# EAGLE design M930 (EAGLE 6.6.0)
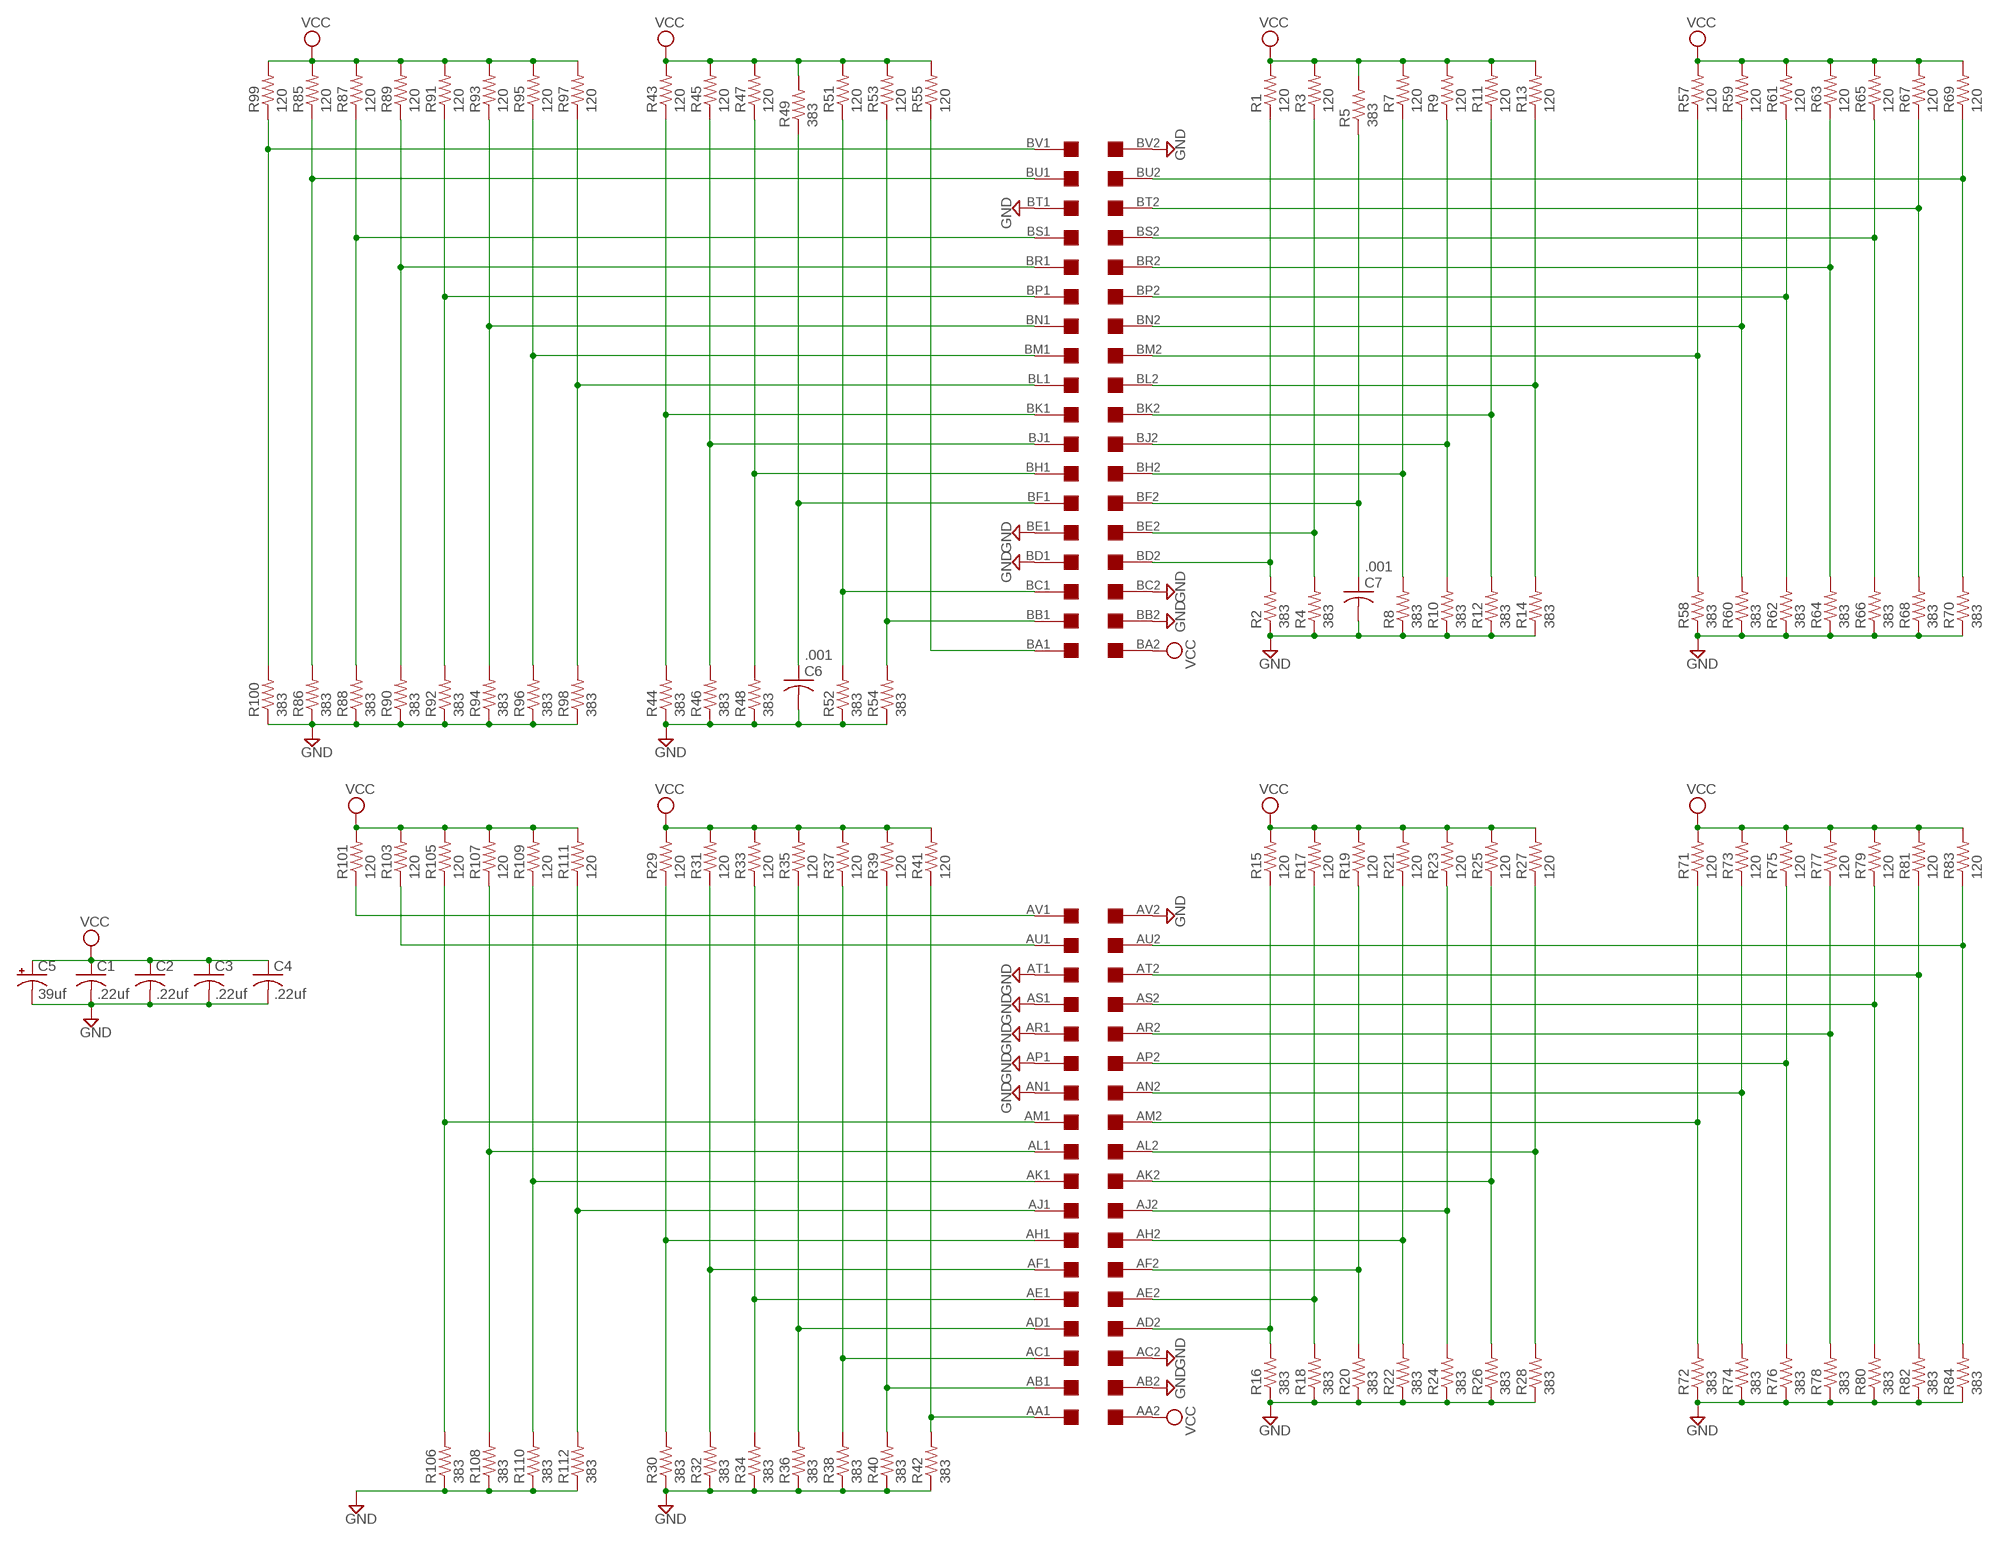
[diagram p0: schematic, sheet 1]

## Parts
C1  .22uf  C-US050-025X075  [C050-025X075]
C2  .22uf  C-US050-025X075  [C050-025X075]
C3  .22uf  C-US050-025X075  [C050-025X075]
C4  .22uf  C-US050-025X075  [C050-025X075]
C5  39uf  CPOL-USE15-5AXIAL  [E15-5]
C6  .001  C-US050-025X075  [C050-025X075]
C7  .001  C-US050-025X075  [C050-025X075]
R1  120  R-US_0207/10  [0207/10]
R2  383  R-US_0207/10  [0207/10]
R3  120  R-US_0207/10  [0207/10]
R4  383  R-US_0207/10  [0207/10]
R5  383  R-US_0207/10  [0207/10]
R7  120  R-US_0207/10  [0207/10]
R8  383  R-US_0207/10  [0207/10]
R9  120  R-US_0207/10  [0207/10]
R10  383  R-US_0207/10  [0207/10]
R11  120  R-US_0207/10  [0207/10]
R12  383  R-US_0207/10  [0207/10]
R13  120  R-US_0207/10  [0207/10]
R14  383  R-US_0207/10  [0207/10]
R15  120  R-US_0207/10  [0207/10]
R16  383  R-US_0207/10  [0207/10]
R17  120  R-US_0207/10  [0207/10]
R18  383  R-US_0207/10  [0207/10]
R19  120  R-US_0207/10  [0207/10]
R20  383  R-US_0207/10  [0207/10]
R21  120  R-US_0207/10  [0207/10]
R22  383  R-US_0207/10  [0207/10]
R23  120  R-US_0207/10  [0207/10]
R24  383  R-US_0207/10  [0207/10]
R25  120  R-US_0207/10  [0207/10]
R26  383  R-US_0207/10  [0207/10]
R27  120  R-US_0207/10  [0207/10]
R28  383  R-US_0207/10  [0207/10]
R29  120  R-US_0207/10  [0207/10]
R30  383  R-US_0207/10  [0207/10]
R31  120  R-US_0207/10  [0207/10]
R32  383  R-US_0207/10  [0207/10]
R33  120  R-US_0207/10  [0207/10]
R34  383  R-US_0207/10  [0207/10]
R35  120  R-US_0207/10  [0207/10]
R36  383  R-US_0207/10  [0207/10]
R37  120  R-US_0207/10  [0207/10]
R38  383  R-US_0207/10  [0207/10]
R39  120  R-US_0207/10  [0207/10]
R40  383  R-US_0207/10  [0207/10]
R41  120  R-US_0207/10  [0207/10]
R42  383  R-US_0207/10  [0207/10]
R43  120  R-US_0207/10  [0207/10]
R44  383  R-US_0207/10  [0207/10]
R45  120  R-US_0207/10  [0207/10]
R46  383  R-US_0207/10  [0207/10]
R47  120  R-US_0207/10  [0207/10]
R48  383  R-US_0207/10  [0207/10]
R49  383  R-US_0207/10  [0207/10]
R51  120  R-US_0207/10  [0207/10]
R52  383  R-US_0207/10  [0207/10]
R53  120  R-US_0207/10  [0207/10]
R54  383  R-US_0207/10  [0207/10]
R55  120  R-US_0207/10  [0207/10]
R57  120  R-US_0207/10  [0207/10]
R58  383  R-US_0207/10  [0207/10]
R59  120  R-US_0207/10  [0207/10]
R60  383  R-US_0207/10  [0207/10]
R61  120  R-US_0207/10  [0207/10]
R62  383  R-US_0207/10  [0207/10]
R63  120  R-US_0207/10  [0207/10]
R64  383  R-US_0207/10  [0207/10]
R65  120  R-US_0207/10  [0207/10]
R66  383  R-US_0207/10  [0207/10]
R67  120  R-US_0207/10  [0207/10]
R68  383  R-US_0207/10  [0207/10]
R69  120  R-US_0207/10  [0207/10]
R70  383  R-US_0207/10  [0207/10]
R71  120  R-US_0207/10  [0207/10]
R72  383  R-US_0207/10  [0207/10]
R73  120  R-US_0207/10  [0207/10]
R74  383  R-US_0207/10  [0207/10]
R75  120  R-US_0207/10  [0207/10]
R76  383  R-US_0207/10  [0207/10]
R77  120  R-US_0207/10  [0207/10]
R78  383  R-US_0207/10  [0207/10]
R79  120  R-US_0207/10  [0207/10]
R80  383  R-US_0207/10  [0207/10]
R81  120  R-US_0207/10  [0207/10]
R82  383  R-US_0207/10  [0207/10]
R83  120  R-US_0207/10  [0207/10]
R84  383  R-US_0207/10  [0207/10]
R85  120  R-US_0207/10  [0207/10]
R86  383  R-US_0207/10  [0207/10]
R87  120  R-US_0207/10  [0207/10]
R88  383  R-US_0207/10  [0207/10]
R89  120  R-US_0207/10  [0207/10]
R90  383  R-US_0207/10  [0207/10]
R91  120  R-US_0207/10  [0207/10]
R92  383  R-US_0207/10  [0207/10]
R93  120  R-US_0207/10  [0207/10]
R94  383  R-US_0207/10  [0207/10]
R95  120  R-US_0207/10  [0207/10]
R96  383  R-US_0207/10  [0207/10]
R97  120  R-US_0207/10  [0207/10]
R98  383  R-US_0207/10  [0207/10]
R99  120  R-US_0207/10  [0207/10]
R100  383  R-US_0207/10  [0207/10]
R101  120  R-US_0207/10  [0207/10]
R103  120  R-US_0207/10  [0207/10]
R105  120  R-US_0207/10  [0207/10]
R106  383  R-US_0207/10  [0207/10]
R107  120  R-US_0207/10  [0207/10]
R108  383  R-US_0207/10  [0207/10]
R109  120  R-US_0207/10  [0207/10]
R110  383  R-US_0207/10  [0207/10]
R111  120  R-US_0207/10  [0207/10]
R112  383  R-US_0207/10  [0207/10]
U$1  DOUBLE  [EDGE-CON4]

## Nets
AA1: R41.1 R42.2 U$1.AA1
AB1: R39.1 R40.2 U$1.AB1
AC1: R37.1 R38.2 U$1.AC1
AD1: R35.1 R36.2 U$1.AD1
AD2: R15.1 R16.2 U$1.AD2
AE1: R33.1 R34.2 U$1.AE1
AE2: R17.1 R18.2 U$1.AE2
AF1: R31.1 R32.2 U$1.AF1
AF2: R19.1 R20.2 U$1.AF2
AH1: R29.1 R30.2 U$1.AH1
AH2: R21.1 R22.2 U$1.AH2
AJ1: R111.1 R112.2 U$1.AJ1
AJ2: R23.1 R24.2 U$1.AJ2
AK1: R109.1 R110.2 U$1.AK1
AK2: R25.1 R26.2 U$1.AK2
AL1: R107.1 R108.2 U$1.AL1
AL2: R27.1 R28.2 U$1.AL2
AM1: R105.1 R106.2 U$1.AM1
AM2: R71.1 R72.2 U$1.AM2
AN2: R73.1 R74.2 U$1.AN2
AP2: R75.1 R76.2 U$1.AP2
AR2: R77.1 R78.2 U$1.AR2
AS2: R79.1 R80.2 U$1.AS2
AT2: R81.1 R82.2 U$1.AT2
AU1: R103.1 U$1.AU1
AU2: R83.1 R84.2 U$1.AU2
AV1: R101.1 U$1.AV1
BA1: R55.1 U$1.BA1
BB1: R53.1 R54.2 U$1.BB1
BC1: R51.1 R52.2 U$1.BC1
BD2: R1.1 R2.2 U$1.BD2
BE2: R3.1 R4.2 U$1.BE2
BF1: C6.1 R49.1 U$1.BF1
BF2: C7.1 R5.1 U$1.BF2
BH1: R47.1 R48.2 U$1.BH1
BH2: R7.1 R8.2 U$1.BH2
BJ1: R45.1 R46.2 U$1.BJ1
BJ2: R9.1 R10.2 U$1.BJ2
BK1: R43.1 R44.2 U$1.BK1
BK2: R11.1 R12.2 U$1.BK2
BL1: R97.1 R98.2 U$1.BL1
BL2: R13.1 R14.2 U$1.BL2
BM1: R95.1 R96.2 U$1.BM1
BM2: R57.1 R58.2 U$1.BM2
BN1: R93.1 R94.2 U$1.BN1
BN2: R59.1 R60.2 U$1.BN2
BP1: R91.1 R92.2 U$1.BP1
BP2: R61.1 R62.2 U$1.BP2
BR1: R89.1 R90.2 U$1.BR1
BR2: R63.1 R64.2 U$1.BR2
BS1: R87.1 R88.2 U$1.BS1
BS2: R65.1 R66.2 U$1.BS2
BT2: R67.1 R68.2 U$1.BT2
BU1: R85.1 R86.2 U$1.BU1
BU2: R69.1 R70.2 U$1.BU2
BV1: R99.1 R100.2 U$1.BV1
GND: C1.2 C2.2 C3.2 C4.2 C5.- C6.2 C7.2 R2.1 R4.1 R8.1 R10.1 R12.1 R14.1 R16.1 R18.1 R20.1 R22.1 R24.1 R26.1 R28.1 R30.1 R32.1 R34.1 R36.1 R38.1 R40.1 R42.1 R44.1 R46.1 R48.1 R52.1 R54.1 R58.1 R60.1 R62.1 R64.1 R66.1 R68.1 R70.1 R72.1 R74.1 R76.1 R78.1 R80.1 R82.1 R84.1 R86.1 R88.1 R90.1 R92.1 R94.1 R96.1 R98.1 R100.1 R106.1 R108.1 R110.1 R112.1 U$1.AB2 U$1.AC2 U$1.AN1 U$1.AP1 U$1.AR1 U$1.AS1 U$1.AT1 U$1.AV2 U$1.BB2 U$1.BC2 U$1.BD1 U$1.BE1 U$1.BT1 U$1.BV2
VCC: C1.1 C2.1 C3.1 C4.1 C5.+ R1.2 R3.2 R5.2 R7.2 R9.2 R11.2 R13.2 R15.2 R17.2 R19.2 R21.2 R23.2 R25.2 R27.2 R29.2 R31.2 R33.2 R35.2 R37.2 R39.2 R41.2 R43.2 R45.2 R47.2 R49.2 R51.2 R53.2 R55.2 R57.2 R59.2 R61.2 R63.2 R65.2 R67.2 R69.2 R71.2 R73.2 R75.2 R77.2 R79.2 R81.2 R83.2 R85.2 R87.2 R89.2 R91.2 R93.2 R95.2 R97.2 R99.2 R101.2 R103.2 R105.2 R107.2 R109.2 R111.2 U$1.AA2 U$1.BA2

## Library data of the parts
C1-C4 C6 C7 = rcl:C-US: CAPACITOR, American symbol
C5 = rcl:CPOL-US: POLARIZED CAPACITOR, American symbol
R1-R5 R7-R49 R51-R55 R57-R101 R103 R105-R112 = rcl:R-US_: RESISTOR, American symbol
U$1 = dec-con:DOUBLE: Double-Height DEC board

## Board
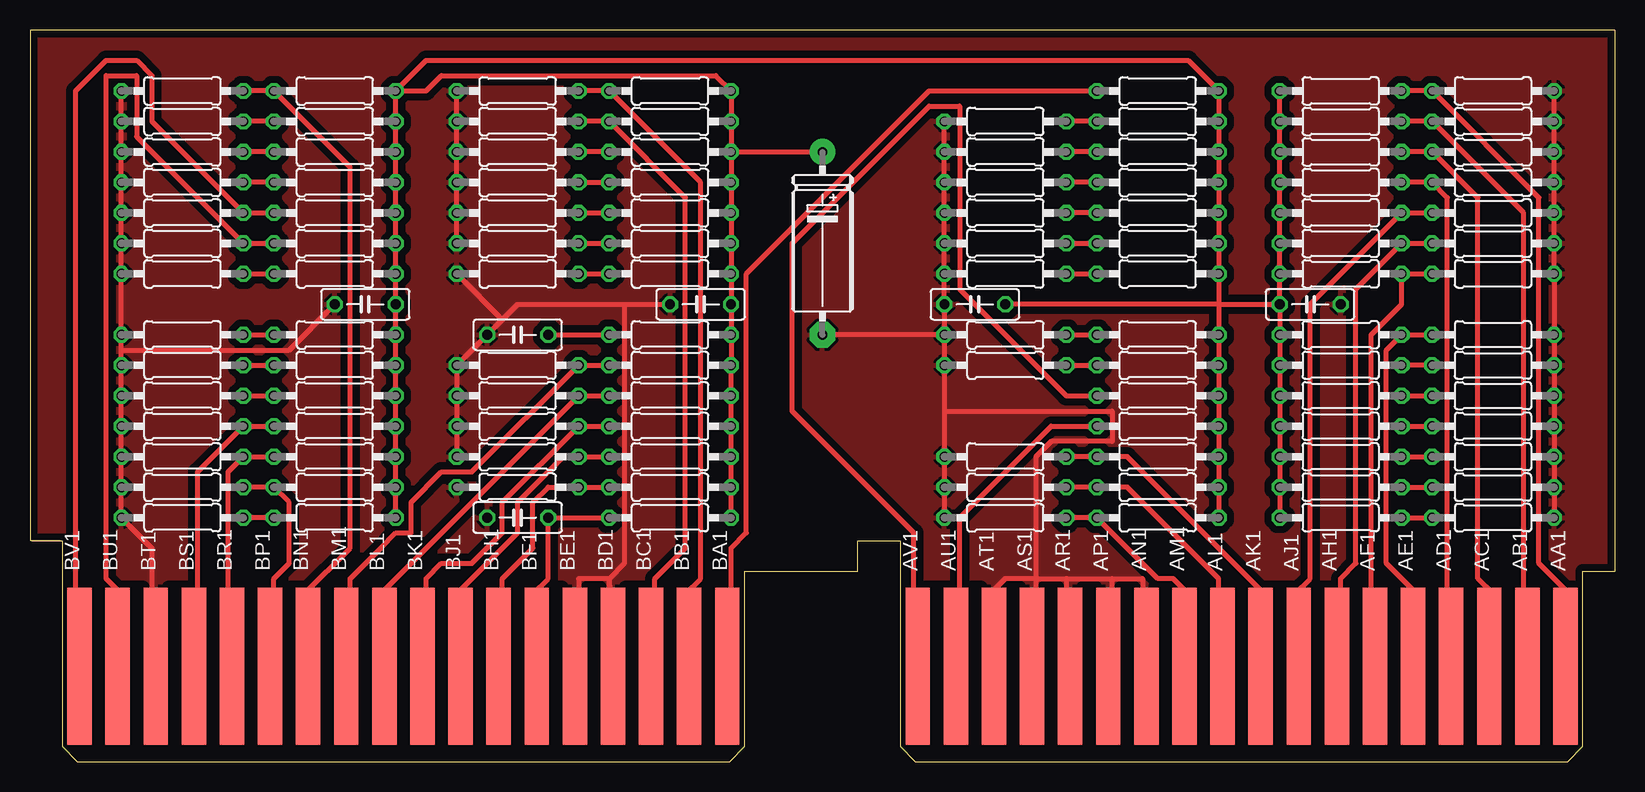
[diagram p1: board, top side]
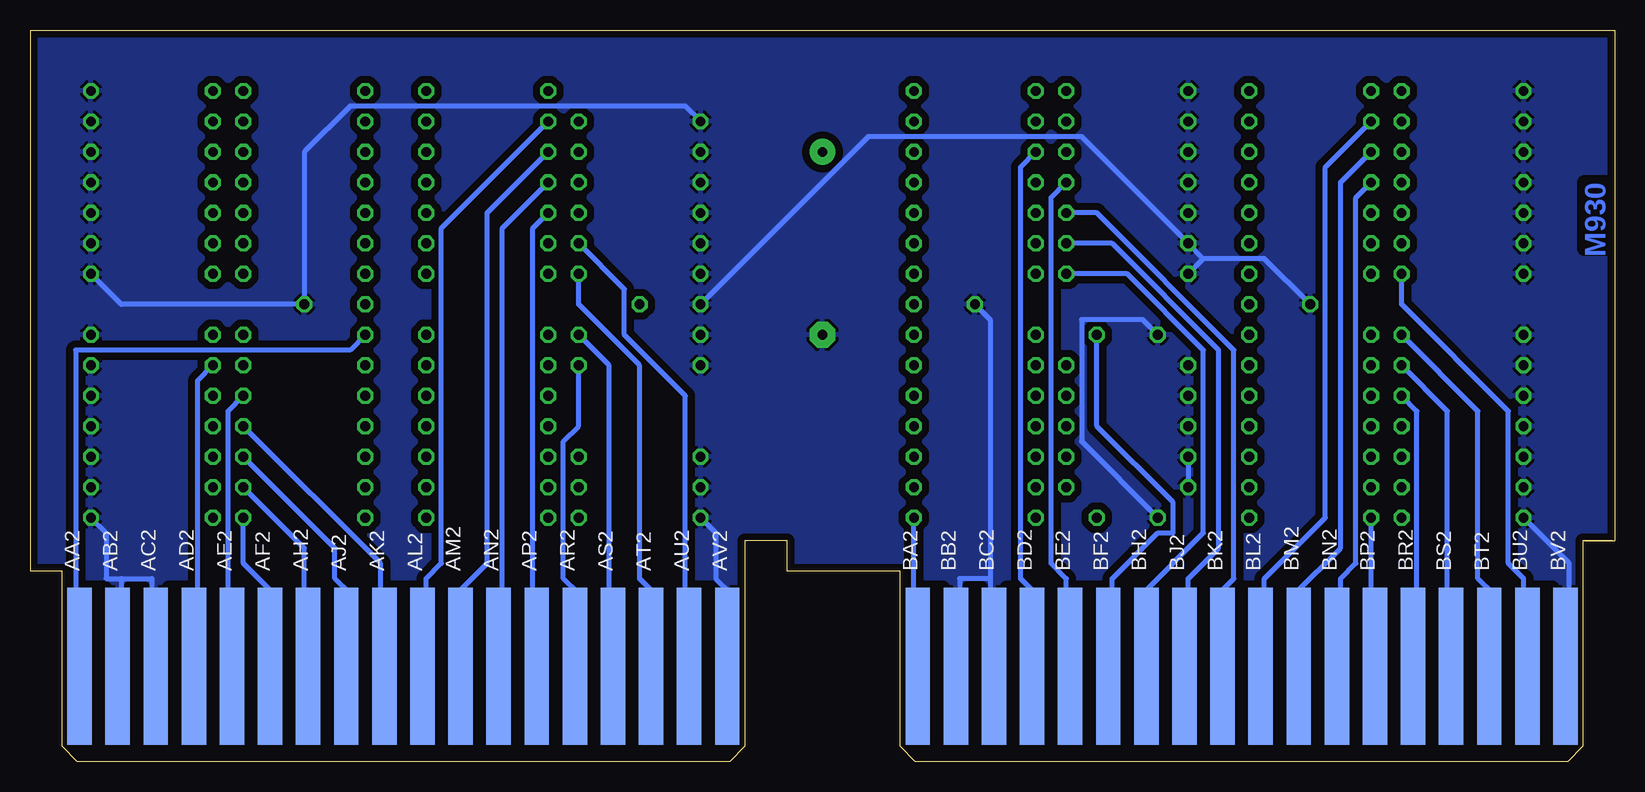
[diagram p2: board, bottom side, seen from below]

Size 132.08 x 60.96 mm. Coordinates in mm from the lower left corner, seen from the top.
Outline: 132.08,15.88 132.08,60.96 0,60.96 0,18.41 2.54,18.41
Copper layers (1+16): Top 0.035mm / dielectric 1.5mm / Bottom 0.035mm
Design rules "16mils": minimum track width 16mil, minimum drill 32mil, track to track 15mil, track to pad 10mil, pad to pad 10mil, via to via 10mil, smd to smd 10mil, copper to edge 13mil, drill to drill 10mil, minimum pad ring 10mil, minimum via ring 8mil, stop-mask expansion 0mil, vias tented up to drill 0mil, thermal gap 10mil

### Footprints (pad centres in the part's own frame; a part is rotated, then mirrored left to right if it is on the bottom)
C050-025X075 = drill 0.813 octagon: 1 -2.54,0; 2 2.54,0
E15-5 = drill 0.813 pad 2.159: + -7.62,0 | drill 0.813 pad 2.159 octagon: - 7.62,0
0207/10 = drill 0.813 octagon: 1 -5.08,0; 2 5.08,0
EDGE-CON4 = smd 13.106 x 2.032: AA1 7.938,4.128; AB1 7.938,7.303; AC1 7.938,10.477; AD1 7.938,13.652; AE1 7.938,16.828; AF1 7.938,20.003; AH1 7.938,23.177; AJ1 7.938,26.352; AK1 7.938,29.527; AL1 7.938,32.703; AM1 7.938,35.877; AN1 7.938,39.053; AP1 7.938,42.227; AR1 7.938,45.403; AS1 7.938,48.578; AT1 7.938,51.752; AU1 7.938,54.928; AV1 7.938,58.102; BA1 7.938,73.978; BB1 7.938,77.153; BC1 7.938,80.328; BD1 7.938,83.502; BE1 7.938,86.677; BF1 7.938,89.853; BH1 7.938,93.028; BJ1 7.938,96.203; BK1 7.938,99.377; BL1 7.938,102.552; BM1 7.938,105.728; BN1 7.938,108.903; BP1 7.938,112.078; BR1 7.938,115.252; BS1 7.938,118.427; BT1 7.938,121.603; BU1 7.938,124.778; BV1 7.938,127.953 | smd 13.106 x 2.032 bottom: AA2 7.938,4.128; AB2 7.938,7.303; AC2 7.938,10.477; AD2 7.938,13.652; AE2 7.938,16.828; AF2 7.938,20.003; AH2 7.938,23.177; AJ2 7.938,26.352; AK2 7.938,29.527; AL2 7.938,32.703; AM2 7.938,35.877; AN2 7.938,39.053; AP2 7.938,42.227; AR2 7.938,45.403; AS2 7.938,48.578; AT2 7.938,51.752; AU2 7.938,54.928; AV2 7.938,58.102; BA2 7.938,73.978; BB2 7.938,77.153; BC2 7.938,80.328; BD2 7.938,83.502; BE2 7.938,86.677; BF2 7.938,89.853; BH2 7.938,93.028; BJ2 7.938,96.203; BK2 7.938,99.377; BL2 7.938,102.552; BM2 7.938,105.728; BN2 7.938,108.903; BP2 7.938,112.078; BR2 7.938,115.252; BS2 7.938,118.427; BT2 7.938,121.603; BU2 7.938,124.778; BV2 7.938,127.953

### Placement (x,y rotation side)
C1  106.68,38.1 0 top
C2  78.74,38.1 180 top
C3  55.88,38.1 180 top
C4  27.94,38.1 180 top
C5  66.04,43.18 270 top
C6  40.64,20.32 180 top
C7  40.64,35.56 180 top
R1  53.34,50.8 0 top
R2  40.64,50.8 0 top
R3  53.34,48.26 0 top
R4  40.64,48.26 0 top
R5  53.34,35.56 0 top
R7  53.34,40.64 0 top
R8  40.64,40.64 0 top
R9  53.34,43.18 0 top
R10  40.64,43.18 0 top
R11  53.34,45.72 0 top
R12  40.64,45.72 0 top
R13  25.4,53.34 0 top
R14  12.7,53.34 0 top
R15  109.22,33.02 180 top
R16  121.92,33.02 180 top
R17  109.22,30.48 180 top
R18  121.92,30.48 180 top
R19  109.22,20.32 180 top
R20  121.92,20.32 180 top
R21  109.22,22.86 180 top
R22  121.92,22.86 180 top
R23  109.22,25.4 180 top
R24  121.92,25.4 180 top
R25  109.22,27.94 180 top
R26  121.92,27.94 180 top
R27  93.98,53.34 0 top
R28  81.28,53.34 0 top
R29  109.22,43.18 180 top
R30  121.92,43.18 180 top
R31  109.22,40.64 180 top
R32  121.92,40.64 180 top
R33  109.22,35.56 180 top
R34  121.92,35.56 180 top
R35  109.22,48.26 180 top
R36  121.92,48.26 180 top
R37  109.22,50.8 180 top
R38  121.92,50.8 180 top
R39  109.22,53.34 180 top
R40  121.92,53.34 180 top
R41  109.22,55.88 180 top
R42  121.92,55.88 180 top
R43  53.34,27.94 0 top
R44  40.64,27.94 0 top
R45  53.34,25.4 0 top
R46  40.64,25.4 0 top
R47  53.34,22.86 0 top
R48  40.64,22.86 0 top
R49  53.34,20.32 0 top
R51  53.34,53.34 0 top
R52  40.64,53.34 0 top
R53  53.34,55.88 0 top
R54  40.64,55.88 0 top
R55  93.98,55.88 0 top
R57  25.4,50.8 0 top
R58  12.7,50.8 0 top
R59  25.4,48.26 0 top
R60  12.7,48.26 0 top
R61  25.4,20.32 0 top
R62  12.7,20.32 0 top
R63  25.4,30.48 0 top
R64  12.7,30.48 0 top
R65  25.4,33.02 0 top
R66  12.7,33.02 0 top
R67  25.4,35.56 0 top
R68  12.7,35.56 0 top
R69  25.4,40.64 0 top
R70  12.7,40.64 0 top
R71  93.98,50.8 0 top
R72  81.28,50.8 0 top
R73  93.98,48.26 0 top
R74  81.28,48.26 0 top
R75  93.98,45.72 0 top
R76  81.28,45.72 0 top
R77  93.98,33.02 0 top
R78  81.28,33.02 0 top
R79  93.98,35.56 0 top
R80  81.28,35.56 0 top
R81  93.98,40.64 0 top
R82  81.28,40.64 0 top
R83  93.98,43.18 0 top
R84  81.28,43.18 0 top
R85  25.4,43.18 0 top
R86  12.7,43.18 0 top
R87  25.4,27.94 0 top
R88  12.7,27.94 0 top
R89  25.4,25.4 0 top
R90  12.7,25.4 0 top
R91  25.4,22.86 0 top
R92  12.7,22.86 0 top
R93  25.4,55.88 0 top
R94  12.7,55.88 0 top
R95  53.34,33.02 0 top
R96  40.64,33.02 0 top
R97  53.34,30.48 0 top
R98  40.64,30.48 0 top
R99  25.4,45.72 0 top
R100  12.7,45.72 0 top
R101  93.98,30.48 0 top
R103  93.98,27.94 0 top
R105  93.98,20.32 0 top
R106  81.28,20.32 0 top
R107  93.98,22.86 0 top
R108  81.28,22.86 0 top
R109  93.98,25.4 0 top
R110  81.28,25.4 0 top
R111  109.22,45.72 180 top
R112  121.92,45.72 180 top
U$1  132.08,0 90 top

### Tracks (layer width: path | path; a pad name or v marks a point on that pad's centre or on a via)
AA1
  Top 0.406: R41.1 R42.2 125.73,46.99 125.73,16.51 128.27,13.97 U$1.AA1
AB1
  Top 0.406: R39.1 R40.2 124.46,45.72 124.46,13.97 U$1.AB1
AC1
  Top 0.406: R37.1 R38.2 120.65,46.99 120.65,15.24 121.92,13.97 U$1.AC1
AD1
  Top 0.406: R35.1 R36.2 118.11,46.99 118.11,13.97 U$1.AD1
AD2
  Top 0.406: R16.2 R15.1
  Bottom 0.406: R16.2 118.11,31.75 118.11,13.97 U$1.AD2
AE1
  Top 0.406: R34.2 R33.1 113.03,34.29 113.03,16.51 115.57,13.97 U$1.AE1
AE2
  Top 0.406: R17.1 R18.2
  Bottom 0.406: R17.1 115.57,29.21 115.57,13.97 U$1.AE2
AF1
  Top 0.406: R32.2 R31.1 114.3,38.1 111.76,35.56 111.76,13.97 U$1.AF1
AF2
  Top 0.406: R19.1 R20.2
  Bottom 0.406: R19.1 114.3,16.51 111.76,13.97 U$1.AF2
AH1
  Top 0.406: R30.2 R29.1 110.49,39.37 110.49,16.51 109.22,15.24 109.22,13.97 U$1.AH1
AH2
  Top 0.406: R21.1 R22.2
  Bottom 0.406: R21.1 109.22,17.78 109.22,13.97 U$1.AH2
AJ1
  Top 0.406: R112.2 R111.1 106.68,38.1 106.68,15.24 105.41,13.97 U$1.AJ1
AJ2
  Top 0.406: R23.1 R24.2
  Bottom 0.406: R23.1 106.68,17.78 106.68,15.24 105.41,13.97 U$1.AJ2
AK1
  Top 0.406: R110.2 R109.1 91.44,25.4 102.87,13.97 U$1.AK1
AK2
  Top 0.406: R25.1 R26.2
  Bottom 0.406: R25.1 102.87,16.51 102.87,13.97 U$1.AK2
AL1
  Top 0.406: R108.2 R107.1 91.44,22.86 99.06,15.24 99.06,13.97 U$1.AL1
AL2
  Top 0.406: R27.1 R28.2
  Bottom 0.406: R27.1 97.79,44.45 97.79,16.51 99.06,15.24 99.06,13.97 U$1.AL2
AM1
  Top 0.406: R106.2 R105.1 93.98,15.24 95.25,15.24 96.52,13.97 U$1.AM1
AM2
  Top 0.406: R71.1 R72.2
  Bottom 0.406: R71.1 93.98,45.72 93.98,16.51 96.52,13.97 U$1.AM2
AN2
  Top 0.406: R73.1 R74.2
  Bottom 0.406: R73.1 92.71,44.45 92.71,13.97 U$1.AN2
AP2
  Top 0.406: R75.1 R76.2
  Bottom 0.406: R75.1 90.17,44.45 90.17,13.97 U$1.AP2
AR2
  Top 0.406: R78.2 R77.1
  Bottom 0.406: R78.2 86.36,27.94 87.63,26.67 87.63,15.24 86.36,13.97 U$1.AR2
AS2
  Top 0.406: R80.2 R79.1
  Bottom 0.406: R80.2 83.82,33.02 83.82,13.97 U$1.AS2
AT2
  Top 0.406: R82.2 R81.1
  Bottom 0.406: R82.2 86.36,38.1 81.28,33.02 81.28,15.24 80.01,13.97 U$1.AT2
AU1
  Top 0.406: R103.1 85.09,27.94 77.47,20.32 77.47,13.97 U$1.AU1
AU2
  Top 0.406: R84.2 R83.1
  Bottom 0.406: R84.2 82.55,39.37 82.55,35.56 77.47,30.48 77.47,13.97 U$1.AU2
AV1
  Top 0.406: R101.1 86.36,30.48 77.47,39.37 77.47,54.61 74.93,54.61 63.5,43.18 63.5,29.21 73.66,19.05 73.66,13.97 U$1.AV1
BA1
  Top 0.406: R55.1 74.93,55.88 59.69,40.64 59.69,19.05 58.42,17.78 58.42,13.97 U$1.BA1
BB1
  Top 0.406: R54.2 R53.1 55.88,48.26 55.88,15.24 54.61,13.97 U$1.BB1
BC1
  Top 0.406: R52.2 R51.1 54.61,46.99 54.61,17.78 52.07,15.24 52.07,13.97 U$1.BC1
BD2
  Top 0.406: R1.1 R2.2
  Bottom 0.406: R1.1 49.53,49.53 49.53,15.24 48.26,13.97 U$1.BD2
BE2
  Top 0.406: R4.2 R3.1
  Bottom 0.406: R4.2 46.99,46.99 46.99,16.51 45.72,15.24 45.72,13.97 U$1.BE2
BF1
  Top 0.406: R49.1 C6.1 43.18,15.24 41.91,13.97 U$1.BF1
BF2
  Top 0.406: C7.1 R5.1
  Bottom 0.406: C7.1 43.18,27.94 36.83,21.59 36.83,19.05 38.1,19.05 41.91,15.24 41.91,13.97 U$1.BF2
BH1
  Top 0.406: R47.1 R48.2 43.18,22.86 41.91,21.59 41.91,17.78 39.37,15.24 39.37,13.97 U$1.BH1
BH2
  Top 0.406: R8.2 R7.1
  Bottom 0.406: R8.2 40.64,40.64 34.29,34.29 34.29,19.05 39.37,13.97 U$1.BH2
BJ1
  Top 0.406: R45.1 R46.2 44.45,25.4 40.64,21.59 40.64,19.05 35.56,13.97 U$1.BJ1
BJ2
  Top 0.406: R10.2 R9.1
  Bottom 0.406: R10.2 41.91,43.18 33.02,34.29 33.02,17.78 35.56,15.24 35.56,13.97 U$1.BJ2
BK1
  Top 0.406: R43.1 R44.2 39.37,21.59 39.37,19.05 36.83,16.51 34.29,16.51 33.02,15.24 33.02,13.97 U$1.BK1
BK2
  Top 0.406: R12.2 R11.1
  Bottom 0.406: R12.2 43.18,45.72 31.75,34.29 31.75,15.24 33.02,13.97 U$1.BK2
BL1
  Top 0.406: R97.1 R98.2 29.21,13.97 U$1.BL1
BL2
  Top 0.406: R13.1 R14.2
  Bottom 0.406: R13.1 24.13,49.53 24.13,20.32 29.21,15.24 29.21,13.97 U$1.BL2
BM1
  Top 0.406: R95.1 R96.2 36.83,24.13 34.29,24.13 31.75,21.59 31.75,19.05 30.48,19.05 29.21,17.78 26.67,15.24 26.67,13.97 U$1.BM1
BM2
  Top 0.406: R57.1 R58.2
  Bottom 0.406: R57.1 22.86,48.26 22.86,17.78 26.67,13.97 U$1.BM2
BN1
  Top 0.406: R94.2 R93.1 26.67,49.53 26.67,17.78 22.86,13.97 U$1.BN1
BN2
  Top 0.406: R59.1 R60.2
  Bottom 0.406: R59.1 21.59,46.99 21.59,16.51 22.86,15.24 22.86,13.97 U$1.BN2
BP1
  Top 0.406: R92.2 R91.1 21.59,21.59 21.59,16.51 20.32,15.24 20.32,13.97 U$1.BP1
BP2
  Top 0.406: R61.1 R62.2
  Bottom 0.406: R61.1 20.32,13.97 U$1.BP2
BR1
  Top 0.406: R89.1 R90.2 16.51,24.13 16.51,13.97 U$1.BR1
BR2
  Top 0.406: R64.2 R63.1
  Bottom 0.406: R64.2 16.51,29.21 16.51,13.97 U$1.BR2
BS1
  Top 0.406: R87.1 R88.2 13.97,24.13 13.97,13.97 U$1.BS1
BS2
  Top 0.406: R66.2 R65.1
  Bottom 0.406: R66.2 13.97,29.21 13.97,13.97 U$1.BS2
BT2
  Top 0.406: R68.2 R67.1
  Bottom 0.406: R68.2 11.43,29.21 11.43,15.24 10.16,13.97 U$1.BT2
BU1
  Top 0.406: R85.1 R86.2 8.89,52.07 8.89,57.15 6.35,57.15 6.35,15.24 7.62,13.97 U$1.BU1
BU2
  Top 0.406: R70.2 R69.1
  Bottom 0.406: R70.2 17.78,38.1 8.89,29.21 8.89,16.51 7.62,15.24 7.62,13.97 U$1.BU2
BV1
  Top 0.406: R99.1 R100.2 10.16,53.34 10.16,57.15 8.89,58.42 6.35,58.42 3.81,55.88 3.81,12.7 U$1.BV1
GND
  Top 0.406: 7.62,34.29 R66.1 R64.1 R88.1 R90.1 R92.1 R62.1 10.16,17.78 10.16,13.97 U$1.BT1 | 7.62,34.29 R68.1 R70.1 R86.1 R100.1 R60.1 R58.1 R14.1 R94.1 | 48.26,15.24 45.72,15.24 45.72,13.97 U$1.BE1 | 48.26,15.24 48.26,13.97 U$1.BD1 48.26,15.24 | R54.1 R52.1 R2.1 R4.1 R12.1 R10.1 | R46.1 R44.1 R98.1 R96.1 C7.2 39.37,36.83 | 49.53,38.1 40.64,38.1 39.37,36.83 | 49.53,38.1 C3.2 | R8.1 39.37,36.83 | 49.53,38.1 49.53,16.51 48.26,15.24 | 7.62,34.29 21.59,34.29 C4.2 | R20.1 R22.1 R24.1 R26.1 R18.1 R16.1 R34.1 R32.1 R30.1 R112.1 R36.1 R38.1 R40.1 R42.1 | 83.82,15.24 81.28,15.24 80.01,13.97 U$1.AT1 | 86.36,15.24 90.17,15.24 | 90.17,15.24 92.71,15.24 92.71,13.97 U$1.AN1 | U$1.AP1 90.17,13.97 90.17,15.24 | 83.82,15.24 86.36,15.24 | 86.36,15.24 86.36,13.97 U$1.AR1 | R28.1 R72.1 R74.1 R76.1 R84.1 R82.1 C2.2 R80.1 | R106.1 R108.1 R110.1 76.2,29.21 | R80.1 R78.1 76.2,29.21 | R80.1 C5.- | 83.82,15.24 83.82,25.4 85.09,26.67 90.17,26.67 90.17,29.21 76.2,29.21 | 83.82,15.24 83.82,13.97 U$1.AS1
  Bottom 0.406: R62.1 3.81,16.51 3.81,12.7 U$1.BV2 | 52.07,15.24 54.61,15.24 54.61,13.97 U$1.BB2 | C4.2 29.21,41.91 34.29,41.91 | 34.29,41.91 R10.1 44.45,52.07 62.23,52.07 C2.2 | 34.29,41.91 R8.1 | R46.1 R48.1 | C6.2 44.45,26.67 44.45,36.83 39.37,36.83 C7.2 | 52.07,15.24 52.07,36.83 C3.2 | 52.07,15.24 52.07,13.97 U$1.BC2 52.07,7.62 | 124.46,15.24 121.92,15.24 121.92,13.97 U$1.AC2 | R32.1 124.46,38.1 C1.2 109.22,50.8 105.41,54.61 77.47,54.61 R28.1 | R20.1 125.73,19.05 125.73,15.24 124.46,15.24 | 124.46,15.24 124.46,13.97 U$1.AB2 | R106.1 74.93,19.05 74.93,15.24 73.66,13.97 U$1.AV2
  pour Bottom (isolate 0.61): 0,60.96 132.08,60.96 132.08,12.7 0,12.7
  pour Top (isolate 0.61): 0,60.96 132.08,60.96 132.08,12.7 0,12.7
VCC
  Top 0.406: R93.2 R13.2 R57.2 R59.2 R99.2 R85.2 R69.2 C4.1 R67.2 R65.2 R63.2 R87.2 R89.2 R91.2 R61.2 | R1.2 R51.2 R53.2 57.15,57.15 34.29,57.15 33.02,55.88 R93.2 | R1.2 C5.+ | R49.2 R47.2 R45.2 R43.2 R97.2 R95.2 R5.2 C3.1 R7.2 R9.2 R11.2 R3.2 R1.2 | R19.2 R21.2 R23.2 R25.2 R17.2 R15.2 R33.2 C1.1 | R105.2 R107.2 R109.2 R103.2 R101.2 R77.2 R79.2 99.06,38.1 | R41.2 R39.2 R37.2 R35.2 R111.2 R29.2 R31.2 C1.1 | 99.06,38.1 C1.1 | 99.06,38.1 C2.1 | 99.06,38.1 R81.2 R83.2 R75.2 R73.2 R71.2 R27.2 R55.2 96.52,58.42 33.02,58.42 R93.2
  Bottom 0.406: R49.2 58.42,13.97 U$1.BA2 | R33.2 105.41,34.29 128.27,34.29 128.27,13.97 U$1.AA2

### Text on the board
Bottom: M930
tValues: M930 Unibus Terminator